# EAGLE design lcsc (EAGLE 7.5.0)
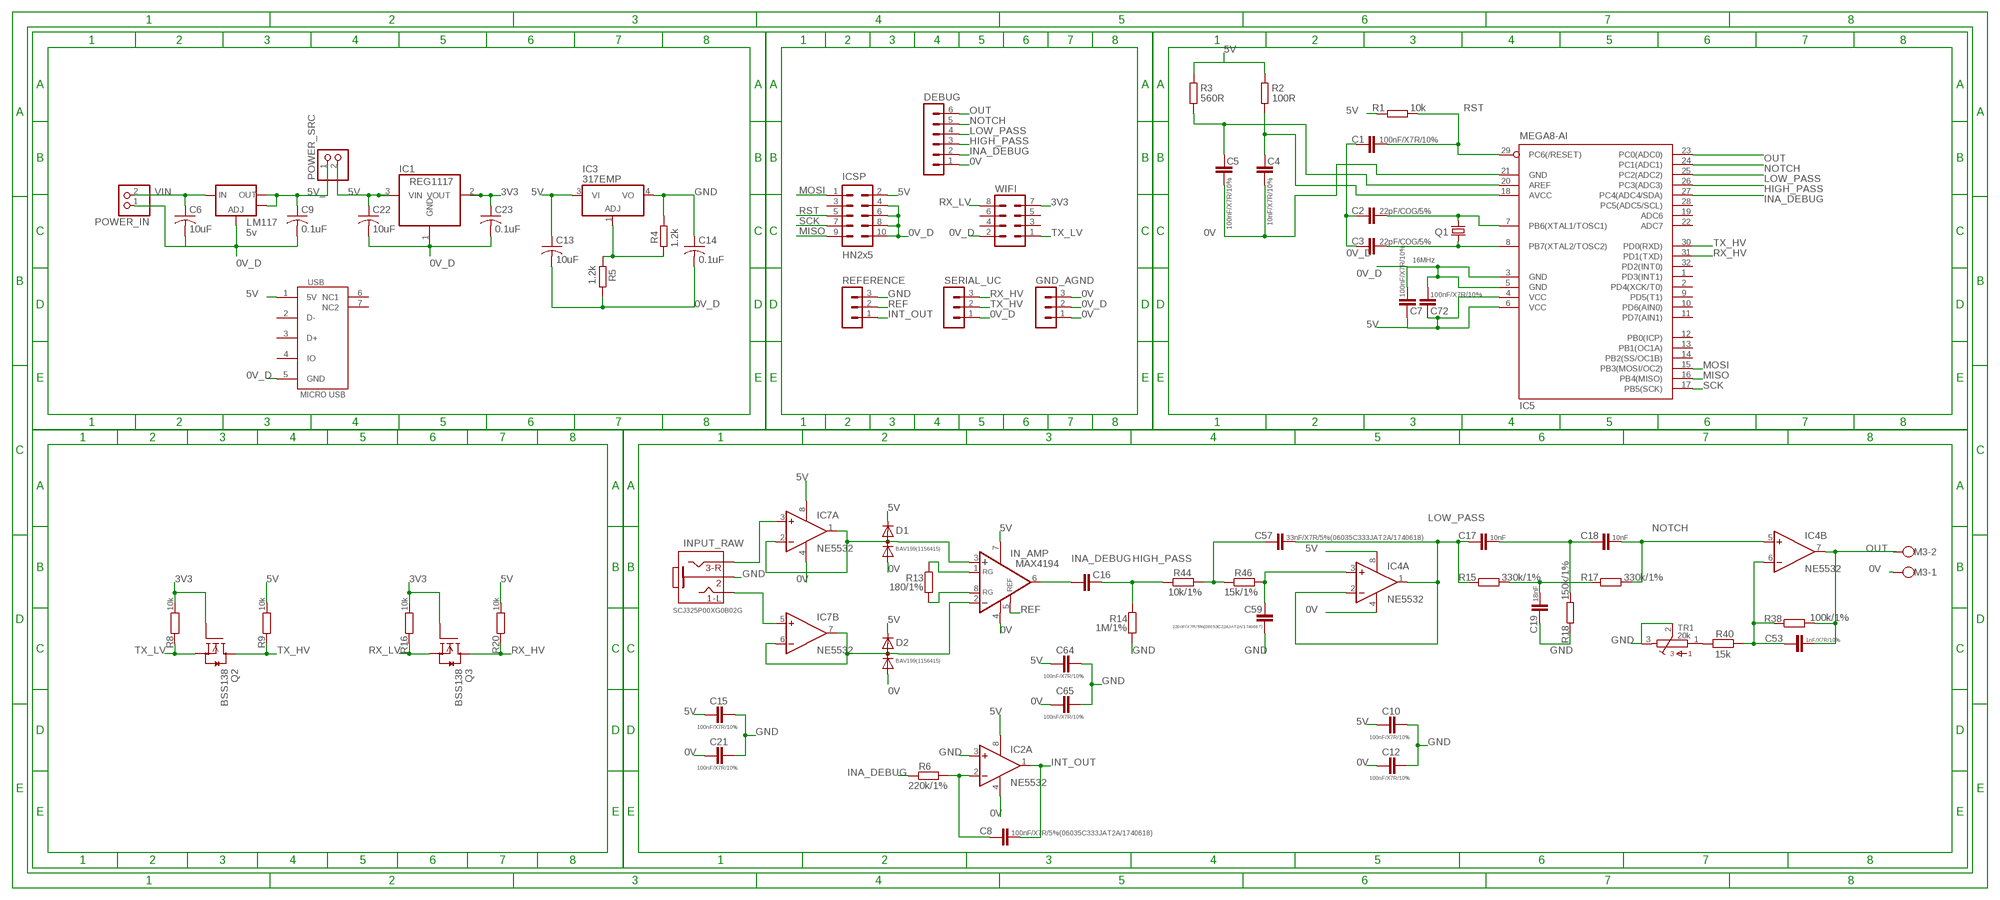
[diagram p0: schematic, sheet 1]

## Parts
C1  100nF/X7R/10%  C-EUC0603_DWS  [C0603_DWS]
C2  22pF/COG/5%  C-EUC0603_DWS  [C0603_DWS]
C3  22pF/COG/5%  C-EUC0603_DWS  [C0603_DWS]
C4  10nF/X7R/10%  C-EUC0603_DWS  [C0603_DWS]
C5  100nF/X7R/10%  C-EUC0603_DWS  [C0603_DWS]
C6  10uF  C-USC0805  [C0805]
C7  100nF/X7R/10%  C-EUC0603_DWS  [C0603_DWS]
C8  100nF/X7R/5%(06035C333JAT2A/1740618)  C-EUC0603_DWS  [C0603_DWS]
C9  0.1uF  C-USC0805  [C0805]
C10  100nF/X7R/10%  C-EUC0603_DWS  [C0603_DWS]
C12  100nF/X7R/10%  C-EUC0603_DWS  [C0603_DWS]
C13  10uF  C-USC0805  [C0805]
C14  0.1uF  C-USC0805  [C0805]
C15  100nF/X7R/10%  C-EUC0603_DWS  [C0603_DWS]
C16  1uF/X5R/10%  C-EUC0603_DWS  [C0603_DWS]
C17  10nF  C-EUC0603_DWS  [C0603_DWS]
C18  10nF  C-EUC0603_DWS  [C0603_DWS]
C19  18nF  C-EUC0603_DWS  [C0603_DWS]
C21  100nF/X7R/10%  C-EUC0603_DWS  [C0603_DWS]
C22  10uF  C-USC0805  [C0805]
C23  0.1uF  C-USC0805  [C0805]
C53  1nF/X7R/10%  C-EUC0603_DWS  [C0603_DWS]
C57  33nF/X7R/5%(06035C333JAT2A/1740618)  C-EUC0603_DWS  [C0603_DWS]
C59  220nF/X7R/5%(08053C224JAT2A/1740667)  C-EUC0805_5MIL_DWS  [C0805_5MIL_DWS]
C64  100nF/X7R/10%  C-EUC0603_DWS  [C0603_DWS]
C65  100nF/X7R/10%  C-EUC0603_DWS  [C0603_DWS]
C72  100nF/X7R/10%  C-EUC0603_DWS  [C0603_DWS]
D1  BAV199(1156415)  DIODE_AC-AC_  [SOT23C(BAT54S)]
D2  BAV199(1156415)  DIODE_AC-AC_  [SOT23C(BAT54S)]
DEBUG  MA06-1  [MA06-1]
GND_AGND  MA03-1  [MA03-1]
IC1  REG1117  [SOT223]
IC2  NE5532  LMV358M  [SO08]
IC3  317EMP  [SOT223]
IC4  NE5532  LMV358M  [SO08]
IC5  MEGA8-AI  [TQFP32-08]
IC7  NE5532  LMV358M  [SO08]
ICSP  HN2x5  ML10ML10_NEW  [ML10_NEW]
IN_AMP  MAX4194  LT1168ACS8  [SOIC8]
INPUT_RAW  SCJ325P00XG0B02G  JACK-3PINPHONE_JACK-SMD  [PHONE_JACK-SMD]
LM117  5v  V_REG_LM1117SOT223  [SOT223]
M3  W237-102  [W237-102]
POWER_IN  PINHD-1X2  [1X02]
POWER_SRC  PINHD-1X2  [1X02]
Q1  16MHz  HC49/S1  [HC49/SMD2_THIN]
Q2  BSS138  [SOT23]
Q3  BSS138  [SOT23]
R1  10k  R-EU_R0603_5MIL_DWS  [R0603_5MIL_DWS]
R2  100R  R-EU_R0603_5MIL_DWS  [R0603_5MIL_DWS]
R3  560R  R-EU_R0603_5MIL_DWS  [R0603_5MIL_DWS]
R4  1.2k  R-EU_R0603_5MIL_DWS  [R0603_5MIL_DWS]
R5  1.2k  R-EU_R0603_5MIL_DWS  [R0603_5MIL_DWS]
R6  220k/1%  R-EU_R0603_5MIL_DWS  [R0603_5MIL_DWS]
R8  10k  R-EU_R0603_5MIL_DWS  [R0603_5MIL_DWS]
R9  10k  R-EU_R0603_5MIL_DWS  [R0603_5MIL_DWS]
R13  180/1%  R-EU_R0603_5MIL_DWS  [R0603_5MIL_DWS]
R14  1M/1%  R-EU_R0603_5MIL_DWS  [R0603_5MIL_DWS]
R15  330k/1%  R-EU_R0603_5MIL_DWS  [R0603_5MIL_DWS]
R16  10k  R-EU_R0603_5MIL_DWS  [R0603_5MIL_DWS]
R17  330k/1%  R-EU_R0603_5MIL_DWS  [R0603_5MIL_DWS]
R18  150k/1%  R-EU_R0603_5MIL_DWS  [R0603_5MIL_DWS]
R20  10k  R-EU_R0603_5MIL_DWS  [R0603_5MIL_DWS]
R38  100k/1%  R-EU_R0603_5MIL_DWS  [R0603_5MIL_DWS]
R40  15k  R-EU_R0603_5MIL_DWS  [R0603_5MIL_DWS]
R44  10k/1%  R-EU_R0603_5MIL_DWS  [R0603_5MIL_DWS]
R46  15k/1%  R-EU_R0603_5MIL_DWS  [R0603_5MIL_DWS]
REFERENCE  MA03-1  [MA03-1]
SERIAL_UC  MA03-1  [MA03-1]
TR1  20k  S64Y  [S64Y]
USB  MICRO_USB  [MICRO_USB]
WIFI  MA04-2  [MA04-2]

## Nets
0V: C4.2 C5.2 C12.1 C21.1 C65.1 D1.1(A) D2.1(A) DEBUG.1 GND_AGND.1 GND_AGND.3 IC2.4(P:V-) IC4.4(P:V-) IC5.21(GND) IC7.4(P:V-) IN_AMP.4(V-) M3.1
0V_D: C1.2 C2.2 C3.2 C6.2 C7.2 C9.2 C13.2 C14.2 C22.2 C23.2 C72.2 GND_AGND.2 IC1.1(GND) IC5.3(GND) IC5.5(GND) ICSP.4 ICSP.6 ICSP.8 ICSP.10 LM117.1(ADJ) POWER_IN.1 R5.1 SERIAL_UC.1 USB.5(GND) WIFI.2
3V3: C23.1 IC1.2(VOUT) Q2.1(G) Q3.1(G) R8.2 R16.2 WIFI.7
4V_REF_ADC: C5.1 IC5.20(AREF) R3.1
5V: C7.1 C10.1 C13.1 C15.1 C22.1 C64.1 C72.1 D1.2(K) D2.2(K) IC1.3(VIN) IC2.8(P:V+) IC3.3(VI) IC4.8(P:V+) IC5.4(VCC) IC5.6(VCC) IC7.8(P:V+) ICSP.2 IN_AMP.7(V+) POWER_SRC.2 R1.1 R2.2 R3.2 R9.2 R20.2 USB.1(5V)
5V_: C9.1 LM117.2(OUT) LM117.4(OUT) POWER_SRC.1
GND: C10.2 C12.2 C14.1 C15.2 C19.1 C21.2 C59.2 C64.2 C65.2 IC2.3(A:+IN) IC3.4(VO) INPUT_RAW.1 R4.1 R14.2 R18.1 REFERENCE.3 TR1.2 TR1.3
HIGH_PASS: C16.2 DEBUG.3 IC5.26(PC3(ADC3)) R14.1 R44.1
INA_DEBUG: C16.1 DEBUG.2 IC5.27(PC4(ADC4/SDA)) IN_AMP.6(OUT) R6.1
INT_OUT: C8.2 IC2.1(A:OUT) REFERENCE.1
LOW_PASS: C17.1 C57.2 DEBUG.4 IC4.1(A:OUT) IC4.2(A:-IN) IC5.25(PC2(ADC2)) R15.1
MISO: IC5.16(PB4(MISO)) ICSP.9
MOSI: IC5.15(PB3(MOSI/OC2)) ICSP.1
N$1: IN_AMP.1(RG) R13.1
N$2: IN_AMP.8(RG) R13.2
N$3: D1.3(AK) IC7.1(A:OUT) IC7.2(A:-IN) IN_AMP.3(+IN)
N$4: IC7.3(A:+IN) INPUT_RAW.2
N$5: IC7.5(B:+IN) INPUT_RAW.5
N$6: IC3.1(ADJ) R4.2 R5.2
N$7: C8.1 IC2.2(A:-IN) R6.2
N$8: C19.2 R15.2 R17.1
N$9: C17.2 C18.1 R18.2
N$11: D2.3(AK) IC7.6(B:-IN) IC7.7(B:OUT) IN_AMP.2(-IN)
N$21: C4.1 IC5.18(AVCC) R2.1
N$27: C3.1 IC5.8(PB7(XTAL2/TOSC2)) Q1.2
N$28: C2.1 IC5.7(PB6(XTAL1/TOSC1)) Q1.1
N$29: R40.2 TR1.1
N$105: C53.1 IC4.6(B:-IN) R38.1 R40.1
N$107: C59.1 IC4.3(A:+IN) R46.2
N$108: C57.1 R44.2 R46.1
NOTCH: C18.2 DEBUG.5 IC4.5(B:+IN) IC5.24(PC1(ADC1)) R17.2
OUT: C53.2 DEBUG.6 IC4.7(B:OUT) IC5.23(PC0(ADC0)) M3.2 R38.2
REF: IN_AMP.5(REF) REFERENCE.2
RST: C1.1 IC5.29(PC6(/RESET)) ICSP.5 R1.2
RX_HV: IC5.31(PD1(TXD)) Q3.3(D) R20.1 SERIAL_UC.3
RX_LV: Q3.2(S) R16.1 WIFI.8
SCK: IC5.17(PB5(SCK)) ICSP.7
TX_HV: IC5.30(PD0(RXD)) Q2.3(D) R9.1 SERIAL_UC.2
TX_LV: Q2.2(S) R8.1 WIFI.1
VIN: C6.1 LM117.3(IN) POWER_IN.2
Unconnected: IC2.5(B:+IN) IC2.6(B:-IN) IC2.7(B:OUT) IC5.1(PD3(INT1)) IC5.2(PD4(XCK/T0)) IC5.9(PD5(T1)) IC5.10(PD6(AIN0)) IC5.11(PD7(AIN1)) IC5.12(PB0(ICP)) IC5.13(PB1(OC1A)) IC5.14(PB2(SS/OC1B)) IC5.19(ADC6) IC5.22(ADC7) IC5.28(PC5(ADC5/SCL)) IC5.32(PD2(INT0)) ICSP.3 USB.2(D-) USB.3(D+) USB.4(IO) USB.6(NC1) USB.7(NC2) WIFI.3 WIFI.4 WIFI.5 WIFI.6

## Library data of the parts
C1-C5 C7 C8 C10 C12 C15-C19 C21 C53 C57 C59 C64 C65 C72 = rcl:C-EU: CAPACITOR, European symbol
C6 C9 C13 C14 C22 C23 = resistor:C-US: CAPACITOR, American symbol
D1 D2 = semicon-smd-ipc:DIODE_AC-AC_: DUAL DIODE
DEBUG = con-lstb:MA06-1: PIN HEADER; OC_FARNELL: unknown; OC_NEWARK: unknown
GND_AGND REFERENCE SERIAL_UC = con-lstb:MA03-1: PIN HEADER; OC_FARNELL: unknown; OC_NEWARK: unknown
IC1 = burr-brown:REG1117: 800mA and 1A Low Dropout (LDO) Positive Regulator 1.8V, 2.5V, 2.85V, 3.3V, 5V, and Adj; MPN: REG1117; OC_FARNELL: 1097566; OC_NEWARK: 14P6981
IC2 IC4 IC7 = linear:LMV358?*: Dual General Purpose, Low Voltage, Rail-to-Rail Output Operational Amplifiers Source: http://www.national.com/mpf/LM/LMV321.html http://www.national.com/dt/lmv_qual.pdf
IC3 = linear:*317: Positive VOLTAGE REGULATOR
IC5 = atmel:MEGA8: MICROCONTROLLER 8 Kbytes FLASH, 1 kbytes SRAM, 512 bytes EEPROM, USART, 6-channel 10 bit ADC, 2-channel 8 bit ADC Pin compatible with Atmega48, ATMega88, ATMega168 Source: avr.lbr; MPN: ATMEGA8-16AU; OC_FARNELL: 9171371; OC_NEWARK: 73M8863
ICSP = con-harting-ml:ML10: HARTING
IN_AMP = linear-technology:LT1168: Low Power, Single Resistor Gain Programmable, Precision Instrumentation Amplifier SourcE: LT1168.pdf; MPN: LT1168ACS8; OC_FARNELL: unknown; OC_NEWARK: 57M2316
INPUT_RAW = gogo:JACK-3PIN
LM117 = SparkFun:V_REG_LM1117: Voltage Regulator LM1117 Standard adjustable voltage regulator but in SMD form. Spark Fun Electronics SKU : COM-00595
M3 = con-wago-500:W237-102: WAGO SCREW CLAMP; MPN: 237-102; OC_FARNELL: unknown; OC_NEWARK: 70K9898
POWER_IN POWER_SRC = pinhead:PINHD-1X2: PIN HEADER
Q1 = crystal:HC49/S: CRYSTAL
Q2 Q3 = m-pad-2.1:BSS138: Fairchild Semiconductors BSS138 N-Channel Logic Level Enhancement Mode Field Effect Transistor General Description: These N-Channel enhancement mode field effect transistors are produced using Fairchild's proprietary, high cell density, DMOS technology. These products have been designed to minimize on-state resistance while provide rugged, reliable, and fast switching performance.These products are particularly suited for low voltage, low current applications such as small servo motor control, power MOSFET gate drivers, and other switching applications. Features: 0.22 A, 50 V. RDS(ON) = 3.5Ohm @ VGS = 10 V RDS(ON) = 6.0Ohm @ VGS = 4.5 V High density cell design for extremely low RDS(ON) Rugged and Reliable Compact industry standard SOT-23 surface mount package Please send any comments to: messi@users.sourceforge.net
R1-R6 R8 R9 R13-R18 R20 R38 R40 R44 R46 = rcl:R-EU_: RESISTOR, European symbol
TR1 = TRIMPOT:S64Y
USB = micro_usb:MICRO_USB
WIFI = con-lstb:MA04-2: PIN HEADER; OC_FARNELL: unknown; OC_NEWARK: unknown

## Net classes
1 pwr: width 0.4 mm, clearance 0.23 mm

## Board
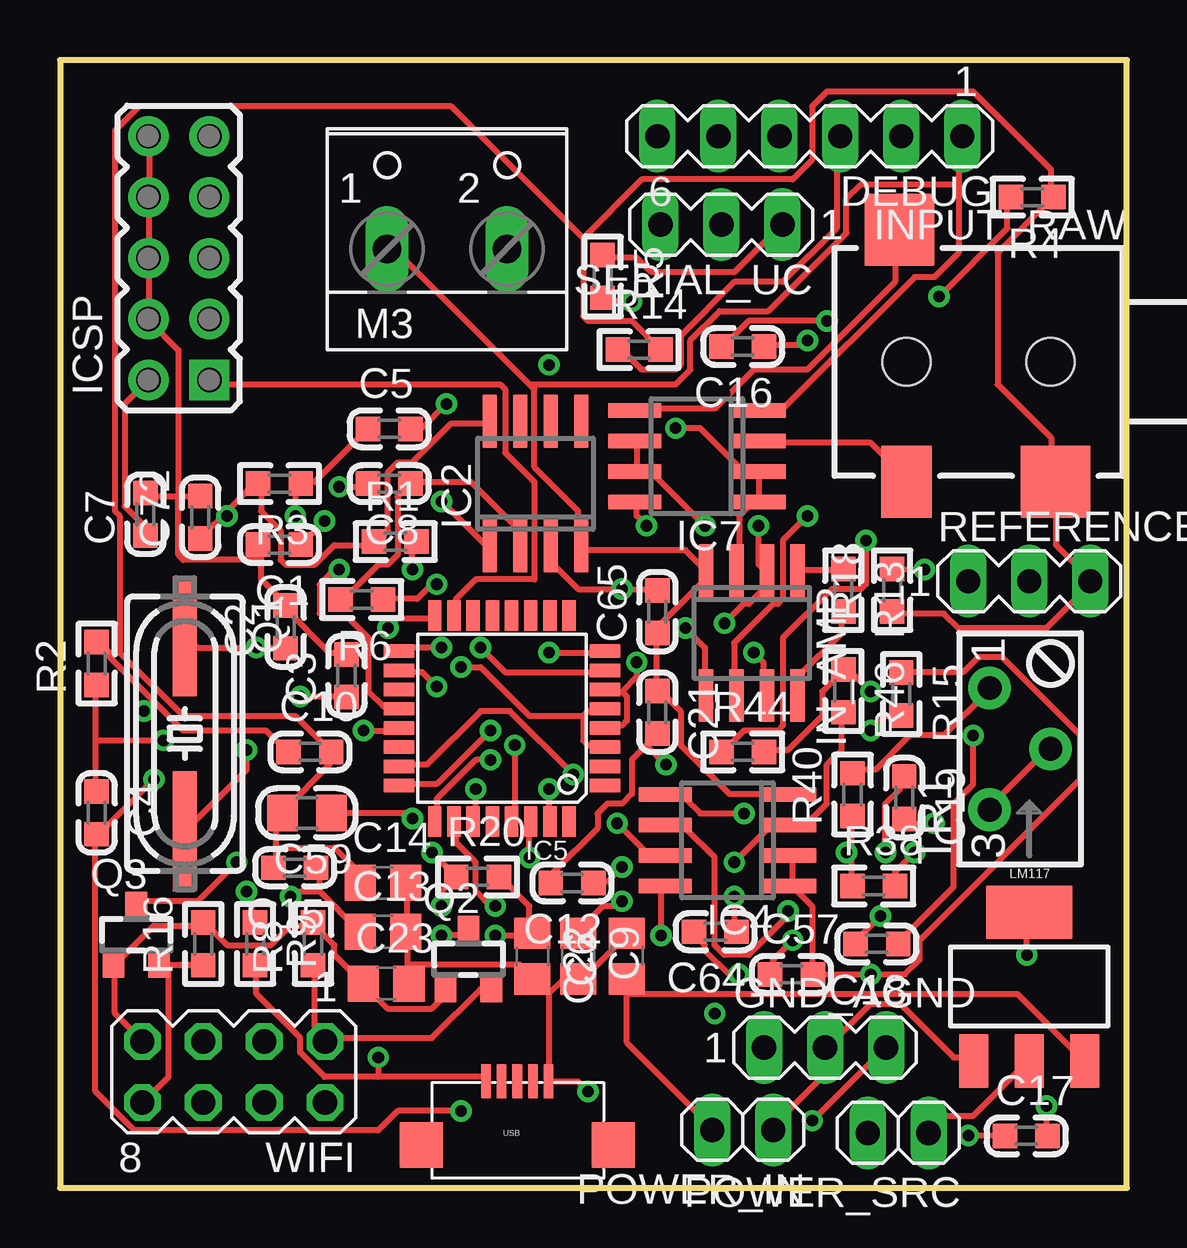
[diagram p1: board, top side]
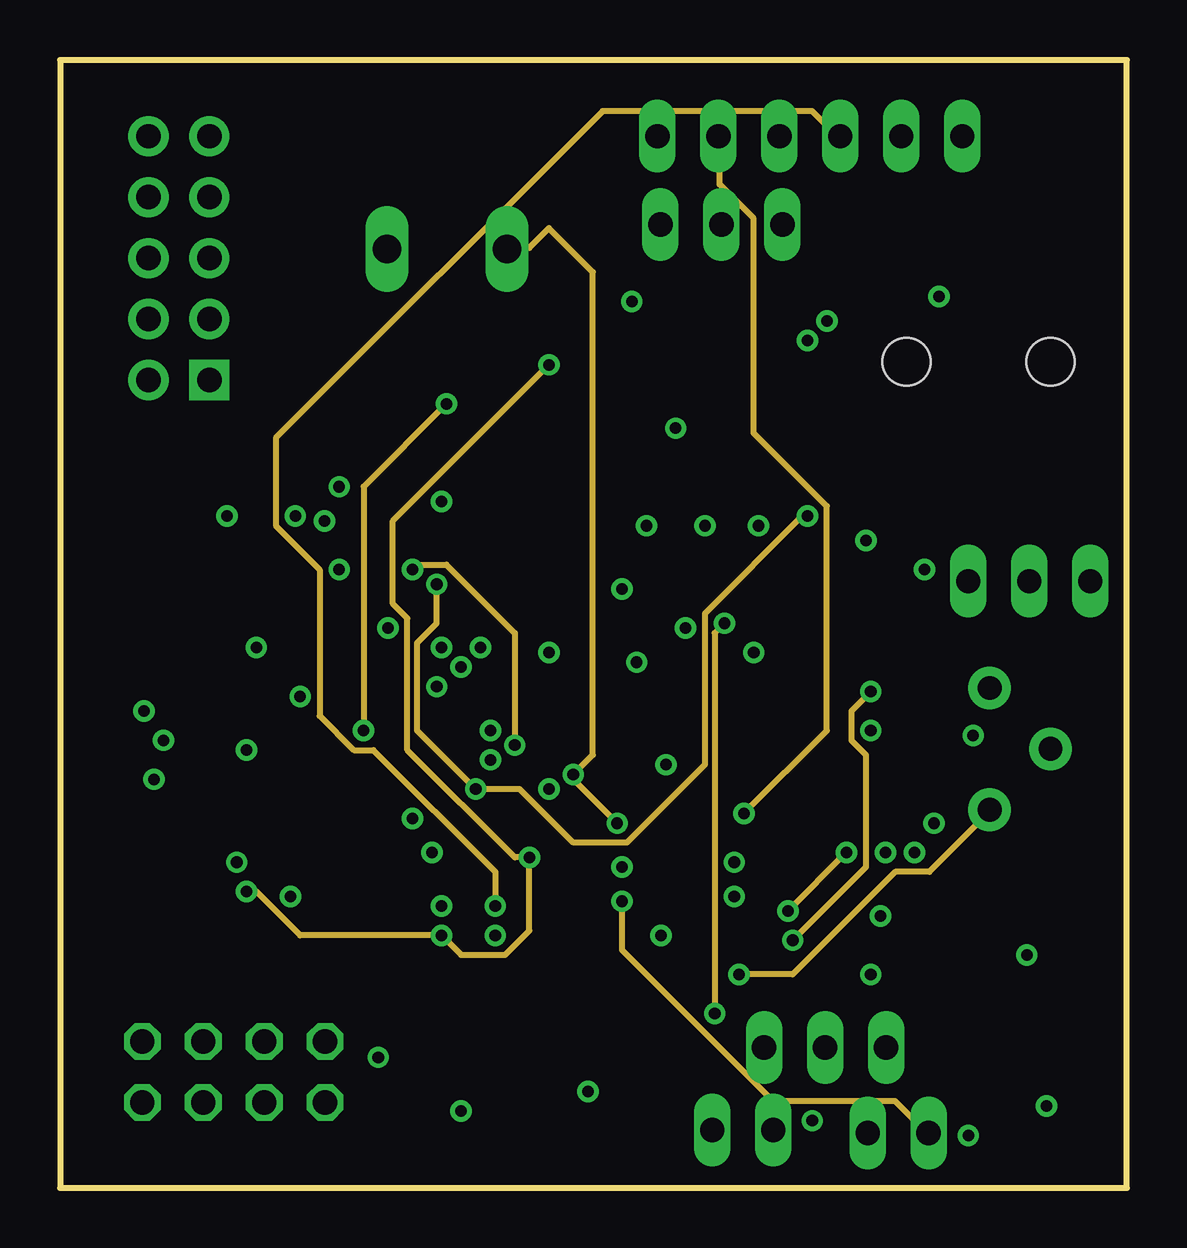
[diagram p2: board, inner layer Route2]
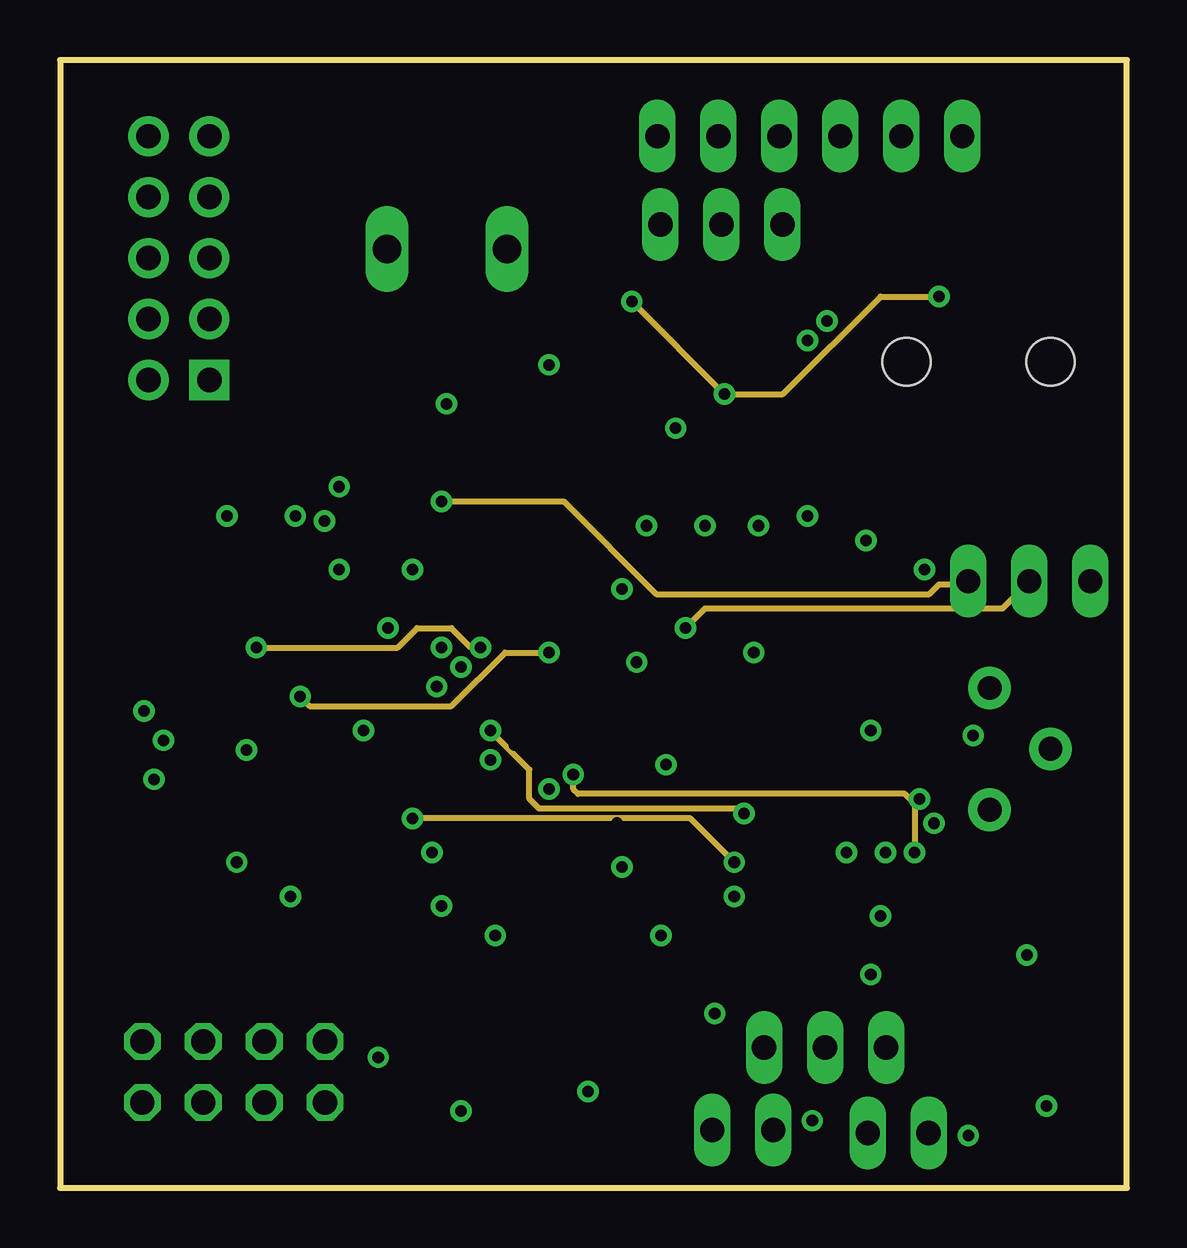
[diagram p3: board, inner layer Route15]
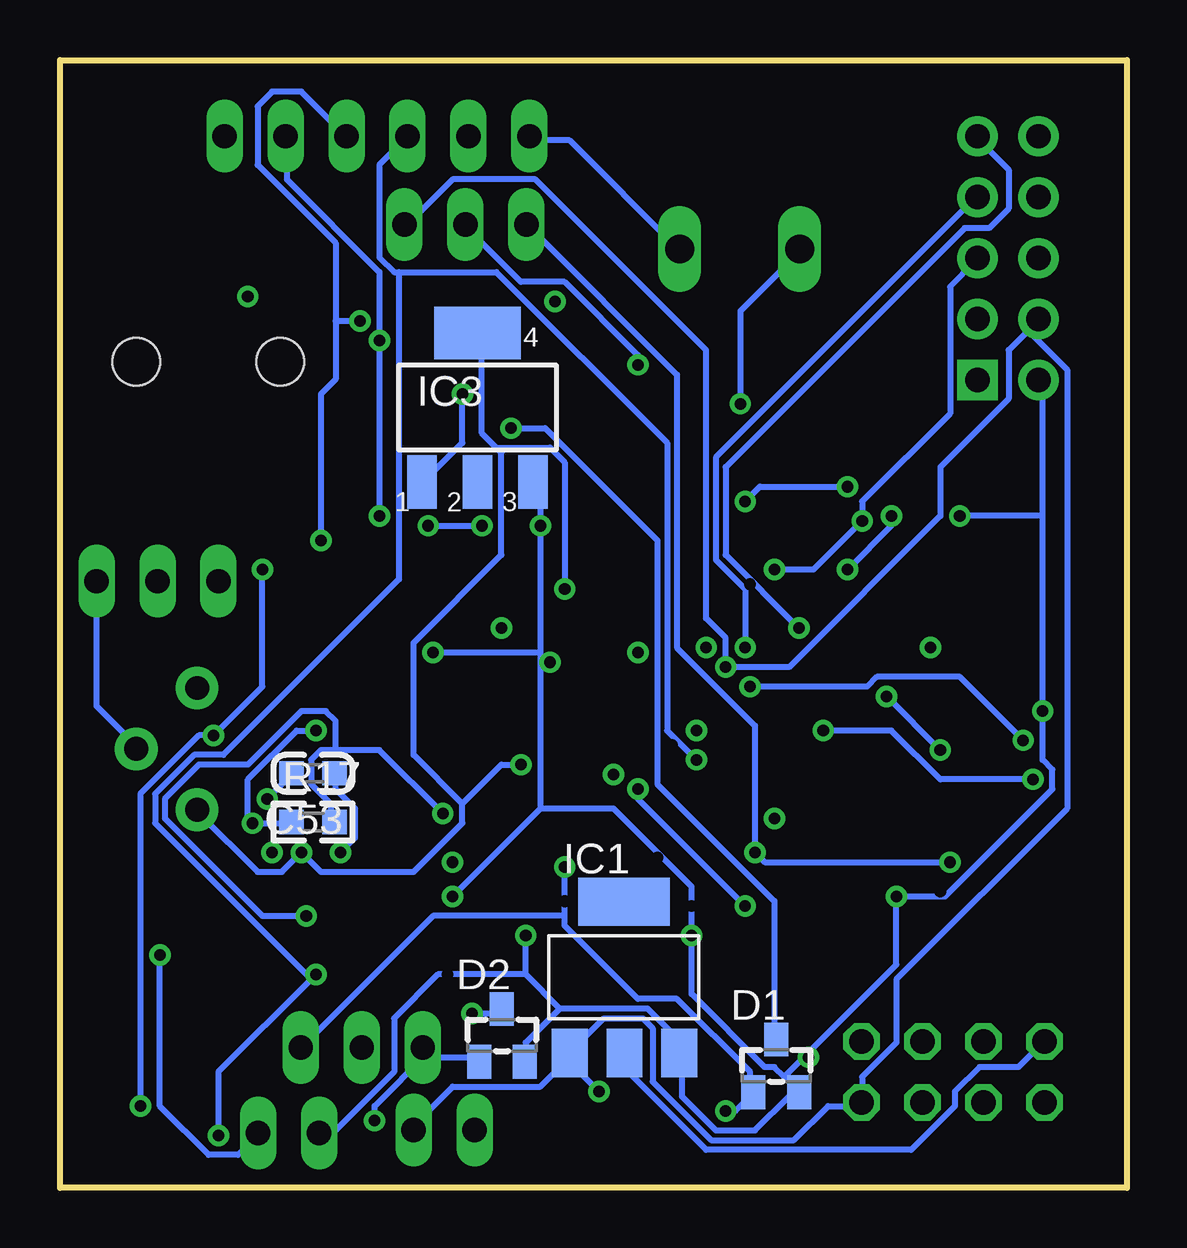
[diagram p4: board, bottom side, seen from below]

Size 44.45 x 46.99 mm. Coordinates in mm from the lower left corner, seen from the top.
Outline: 0,46.99 0,0 44.45,0 44.45,46.99 0,46.99
Copper layers ((1*2)+(15*16)): Top 0.09mm / dielectric 0.2mm / Route2 0.07mm / dielectric 1.5mm / Route15 0.07mm / dielectric 0.2mm / Bottom 0.09mm
Design rules "default *": minimum track width 10mil, minimum drill 19mil, track to track 6mil, track to pad 6mil, pad to pad 8mil, via to via 8mil, smd to smd 6mil, copper to edge 40mil, drill to drill 8mil, minimum pad ring 10mil, minimum via ring 8mil, stop-mask expansion 4mil, vias tented up to drill 0mil, thermal gap 10mil

### Footprints (pad centres in the part's own frame; a part is rotated, then mirrored left to right if it is on the bottom)
C0603_DWS = smd 1.016 x 1.016: 1 -0.889,0; 2 0.889,0
C0805 = smd 1.3 x 1.5: 1 -0.95,0; 2 0.95,0
C0805_5MIL_DWS = smd 1.27 x 1.524: 1 -1.016,0; 2 1.016,0
SOT23C(BAT54S) = smd 1 x 1.4: 1 -0.95,-1.1; 2 0.95,-1.1; 3 0,1.1
MA06-1 = drill 1.016 long: 1 -6.35,0; 2 -3.81,0; 3 -1.27,0; 4 1.27,0; 5 3.81,0; 6 6.35,0
MA03-1 = drill 1.016 long: 1 -2.54,0; 2 0,0; 3 2.54,0
SOT223 = smd 1.499 x 2.007: 1 -2.261,-3.15; 2 0.025,-3.15; 3 2.311,-3.15 | smd 3.81 x 2.007: 4 0,3.15
SO08 = smd 0.6 x 2.2: 1 -1.905,-2.6; 2 -0.635,-2.6; 3 0.635,-2.6; 4 1.905,-2.6; 5 1.905,2.6; 6 0.635,2.6; 7 -0.635,2.6; 8 -1.905,2.6
SOT223' = smd 1.219 x 2.235: 1 -2.311,-3.099; 2 0,-3.099; 3 2.311,-3.099 | smd 3.6 x 2.2: 4 0,3.099
TQFP32-08 = smd 1.27 x 0.559: 1 -4.293,2.8; 2 -4.293,2; 3 -4.293,1.2; 4 -4.293,0.4; 5 -4.293,-0.4; 6 -4.293,-1.2; 7 -4.293,-2; 8 -4.293,-2.8; 17 4.293,-2.8; 18 4.293,-2; 19 4.293,-1.2; 20 4.293,-0.4; 21 4.293,0.4; 22 4.293,1.2; 23 4.293,2; 24 4.293,2.8 | smd 0.559 x 1.27: 9 -2.8,-4.293; 10 -2,-4.293; 11 -1.2,-4.293; 12 -0.4,-4.293; 13 0.4,-4.293; 14 1.2,-4.293; 15 2,-4.293; 16 2.8,-4.293; 25 2.8,4.293; 26 2,4.293; 27 1.2,4.293; 28 0.4,4.293; 29 -0.4,4.293; 30 -1.2,4.293; 31 -2,4.293; 32 -2.8,4.293
ML10_NEW = drill 1.016 pad 1.676 square: 1 -5.08,-1.27 | drill 1.016 pad 1.676: 2 -5.08,1.27; 3 -2.54,-1.27; 4 -2.54,1.27; 5 0,-1.27; 6 0,1.27; 7 2.54,-1.27; 8 2.54,1.27; 9 5.08,-1.27; 10 5.08,1.27
SOIC8 = smd 0.6 x 2.2: 1 -1.905,-2.6; 2 -0.635,-2.6; 3 0.635,-2.6; 4 1.905,-2.6; 5 1.905,2.6; 6 0.635,2.6; 7 -0.635,2.6; 8 -1.905,2.6
PHONE_JACK-SMD = smd 2.9 x 3: 1 -0.2,5; 5 6.3,-5.5 | smd 2.1 x 3: 2 6,5 | hole 2: 0,0; 6,0
W237-102 = drill 1.194 long: 1 -2.5,-1.27; 2 2.5,-1.27
1X02 = drill 1.016 long: 1 -1.27,0; 2 1.27,0
HC49/SMD2_THIN = smd 5 x 1: 1 -4.064,0; 2 4.064,0
SOT23 = smd 0.9 x 1.2: 1 -0.95,-1.2; 2 0.95,-1.2; 3 0,1.2
R0603_5MIL_DWS = smd 1.016 x 1.016: 1 -0.889,0; 2 0.889,0
S64Y = drill 0.991 pad 1.778: 1 2.54,1.27; 2 0,-1.27; 3 -2.54,1.27
MICRO_USB = smd 0.4 x 1.4: 1 -1.3,2.15; 2 -0.65,2.15; 3 0,2.15; 4 0.65,2.15; 5 1.3,2.15 | smd 1.8 x 1.9: 6 -4,-0.5; 7 4,-0.5
MA04-2 = drill 1.016 octagon: 1 -3.81,-1.27; 2 -3.81,1.27; 3 -1.27,-1.27; 4 -1.27,1.27; 5 1.27,-1.27; 6 1.27,1.27; 7 3.81,-1.27; 8 3.81,1.27

### Placement (x,y rotation side)
C1  9.14,26.8 180 top
C2  9.4,23.37 90 top
C3  11.94,21.34 90 top
C4  1.52,15.62 270 top
C5  13.72,31.62 0 top
C6  23.62,9.65 90 top
C7  3.56,28.07 90 top
C8  13.72,29.34 180 top
C9  21.59,9.65 270 top
C10  10.41,18.16 0 top
C12  21.34,12.7 180 top
C13  13.46,10.67 0 top
C14  13.46,12.7 0 top
C15  9.78,13.34 180 top
C16  28.45,35.05 180 top
C17  40.26,2.16 0 top
C18  34.04,10.16 180 top
C19  35.18,16.26 270 top
C21  24.89,19.81 270 top
C22  19.69,9.65 270 top
C23  13.59,8.51 0 top
C53  33.91,17.27 180 bottom
C57  30.48,8.89 0 top
C59  10.29,15.62 180 top
C64  27.31,10.67 180 top
C65  24.89,24 90 top
C72  5.84,27.94 90 top
D1  14.61,5.08 0 bottom
D2  26.04,6.35 0 bottom
DEBUG  31.24,43.81 180 top
GND_AGND  31.88,5.84 0 top
IC1  20.96,8.76 0 bottom
IC2  19.81,29.34 0 top
IC3  317EMP  [SOT223']  27.05,32.51 0 bottom
IC4  27.81,14.48 90 top
IC5  18.41,19.56 180 top
IC7  26.54,30.48 90 top
ICSP  4.95,38.73 90 top
IN_AMP  28.83,23.11 180 top
INPUT_RAW  41.28,34.42 180 top
LM117  5v  [SOT223']  40.39,8.38 0 top
M3  16.13,40.39 0 top
POWER_IN  28.45,2.41 180 top
POWER_SRC  34.93,2.29 180 top
Q1  5.21,18.92 270 top
Q2  17.02,9.53 0 top
Q3  3.18,10.54 0 top
R1  13.97,26.92 0 top
R2  1.52,21.84 90 top
R3  9.14,29.34 180 top
R4  40.51,41.27 180 top
R5  22.61,37.97 270 top
R6  12.57,24.51 180 top
R8  10.54,10.16 90 top
R9  8.13,10.16 270 top
R13  32.64,24.89 270 top
R14  24.13,34.92 0 top
R15  35.05,20.57 270 top
R16  5.97,10.16 90 top
R17  33.91,15.24 0 bottom
R18  34.67,24.89 90 top
R20  17.4,12.95 0 top
R38  33.91,12.57 0 top
R40  33.02,16.38 90 top
R44  28.45,18.16 0 top
R46  32.64,20.7 270 top
REFERENCE  40.39,25.27 0 top
SERIAL_UC  27.56,40.13 180 top
TR1  40.01,18.29 90 top
USB  19.05,2.29 0 top
WIFI  7.24,4.83 180 top

### Tracks (layer width: path | path; a pad name or v marks a point on that pad's centre or on a via)
0V  (via drill 0.48)
  Top 0.254: v16.71,3.2 14.07,3.2 13.26,2.39 3.1,2.39 1.47,4.01 1.47,14.58 C4.2 1.68,14.78 v3.91,17.02 | v23.42,13.36 22.81,12.75 22.4,12.75 C12.1 | v12.65,19.05 14.07,19.05 IC5.21 | v31.34,2.79 34.39,5.84 GND_AGND.3 | 37.44,41.81 37.44,43.64 DEBUG.1 | 37.44,41.81 37.44,38.96 36.42,37.95 35.61,37.95 30.12,32.46 29.31,32.46 IC7.4 | v16.1,32.66 15.09,31.65 14.68,31.65 C5.2 | IC4.4 30.33,16.41 27.89,16.41 25.86,18.44 25.86,19.86 25.04,20.68 C21.1 24.84,20.88 24.84,23.11 C65.1 25.04,23.11 25.04,23.52 27.08,25.55 IN_AMP.4 26.87,25.76 26.06,26.57 21.79,26.57 IC2.4 21.59,26.77 21.59,28.19 19.76,30.02 19.76,33.27 19.56,33.48 | 19.56,33.48 14.07,38.96 13.67,38.96 M3.1 | 37.44,41.81 33.38,41.81 32.77,41.2 32.77,39.78 29.52,36.52 27.48,36.52 26.26,35.31 26.26,34.09 25.65,33.48 19.56,33.48
  Route2 0.254: v12.65,19.05 12.65,29.21 v16.1,32.66
  Bottom 0.254: 29.11,5.64 29.31,5.84 GND_AGND.1 29.11,5.64 | 29.11,5.64 28.91,5.44 27.08,5.44 D2.1 | v16.71,3.2 16.31,3.2 15.7,3.81 D1.1 15.7,4.01 15.7,4.83 18.75,7.87 20.37,7.87 23.42,10.92 23.42,11.33 | 23.42,11.33 v23.42,13.36 | v12.65,19.05 9.8,19.05 7.77,17.02 v3.91,17.02 | 23.42,11.33 28.91,11.33 34.39,5.84 GND_AGND.3 | 29.11,5.64 31.34,3.4 v31.34,2.79 | v16.1,32.66 16.1,36.52 13.67,38.96 M3.1
0V_D  (via drill 0.48)
  Top 0.254: 14.48,9.3 14.48,10.52 C13.2 14.48,10.72 14.48,12.55 C14.2 | 14.48,9.3 14.48,8.69 C23.2 | 20.37,8.08 20.37,4.62 USB.5 20.37,4.42 21.59,4.42 v22,4.01 | 20.37,8.08 19.76,8.69 C22.2 | 20.37,8.08 20.98,8.69 21.59,8.69 C9.2 21.59,8.89 22,8.89 23.62,10.52 C6.2 | 20.37,8.08 C22.2 | 14.48,9.3 19.15,9.3 19.56,8.89 C22.2 | LM117.1 38.05,5.44 37.24,5.44 35,7.67 33.78,7.67 31.95,5.84 GND_AGND.2 31.75,5.84 31.75,4.62 29.72,2.59 POWER_IN.1 | 4.93,28.8 3.71,28.8 C7.2 | 4.93,28.8 5.74,28.8 C72.2 | 8.38,26.16 8.38,25.35 9.4,24.33 C2.2 9.4,24.13 11.23,22.3 11.84,22.3 C3.2 | 8.38,26.16 8.38,26.77 C1.2 | 4.93,28.8 4.93,26.37 5.13,26.16 8.38,26.16 | R5.1 22.61,38.76 24.03,38.76 24.64,38.15 28.09,38.15 29.92,39.98 SERIAL_UC.1 | ICSP.10 3.71,43.64 3.71,41.4 ICSP.8 3.71,41.2 3.71,38.76 ICSP.6 3.71,38.56 3.71,36.32 ICSP.4 3.71,36.12 4.93,34.9 4.93,28.8 | 21.79,19.66 21.79,18.64 22,18.44 22.61,18.44 IC5.3 | 21.79,19.66 22,19.86 22.61,19.86 IC5.5 | 21.79,19.66 19.56,19.66 17.53,21.69 v16.71,21.69
  Bottom 0.254: 23.22,5.44 24.44,4.22 28.09,4.22 29.72,2.59 POWER_IN.1 | v22,4.01 23.22,5.23 23.22,5.44 | 23.22,5.44 IC1.1 23.22,5.64 21.79,7.06 20.17,7.06 19.76,6.66 19.76,4.42 17.32,1.98 13.87,1.98 12.45,3.4 11.23,3.4 WIFI.2 11.02,3.61 11.02,4.62 9.6,6.05 9.6,8.69 2.49,15.8 2.49,34.09 4.12,35.71 | 4.12,35.71 3.71,36.12 ICSP.4 4.12,35.71 | 4.12,35.71 4.93,34.9 4.93,32.87 7.77,30.02 7.77,27.99 14.07,21.69 v16.71,21.69 16.71,22.91 17.53,23.72 17.53,34.9 24.64,42.01 28.09,42.01 29.92,40.18 SERIAL_UC.1
3V3
  Top 0.254: Q2.1 15.9,8.28 15.9,7.87 15.49,7.47 13.67,7.47 12.65,8.48 C23.1 12.45,8.69 11.43,9.7 11.43,10.11 10.62,10.92 R8.2 10.41,10.92 9.6,10.92 8.79,10.11 6.96,10.11 6.15,10.92 R16.2 5.94,10.92 3.91,10.92 2.29,9.3 | 2.29,9.3 2.29,7.26 3.3,6.25 WIFI.7 | 2.29,9.3 Q3.1
  Bottom 0.254: IC1.2 20.78,5.44 20.78,4.83 17.53,1.57 8.99,1.57 7.16,3.4 7.16,4.01 6.15,5.03 4.52,5.03 3.51,6.05 WIFI.7
4V_REF_ADC  (via drill 0.48)
  Top 0.254: C5.1 10.62,29.41 10.21,29.41 R3.1 10.01,29.21 9.8,29.01 v9.8,27.99 | v11.63,25.76 11.43,25.76 10.82,25.15 10.82,23.93 11.02,23.72 12.04,23.72 12.85,22.91 12.85,20.68 13.46,20.07 14.07,20.07 IC5.20
  Bottom 0.254: v11.63,25.76 9.8,27.58 v9.8,27.99
5V  (via drill 0.48)
  Top 0.254: 23.42,20.68 23.62,20.47 23.62,19.46 23.42,19.25 22.81,19.25 IC5.4 | 23.42,20.68 22.81,20.68 IC5.6 | v28.09,12.14 28.09,10.72 C64.1 | 23.42,20.68 24.03,21.29 v24.03,21.89 | v24.44,27.58 24.03,27.99 24.03,28.4 IC7.8 | v28.91,22.3 29.31,21.89 29.31,20.68 IN_AMP.7 | 6.96,28.19 8.18,29.41 R3.2 8.38,29.21 8.38,28.19 9.2,27.38 9.2,26.16 9.4,25.96 10.62,25.96 11.43,26.77 13.06,26.77 R1.1 13.26,26.98 13.67,27.38 13.67,29.82 14.07,30.23 14.68,30.23 16.31,31.85 17.73,31.85 IC2.8 | 6.96,28.19 5.94,27.18 C72.1 | 13.26,4.62 17.73,4.62 USB.1 | 13.26,4.62 11.02,4.62 10.01,5.64 10.01,6.25 8.18,8.08 8.18,9.09 R9.2 | 3.91,20.27 5.13,19.05 8.59,19.05 9.4,18.24 C10.1 | 3.91,20.27 2.08,22.1 2.08,22.3 1.68,22.71 R2.2 | ICSP.2 2.69,32.66 2.69,28.4 3.51,27.58 3.51,27.18 C7.1 | 10.82,12.34 10.82,13.16 C15.1 | 10.82,12.34 12.45,10.72 C13.1 | R20.2 18.34,12.95 19.56,11.73 19.56,10.72 C22.1 19.56,10.52 v18.14,10.52 | v25.04,10.52 25.04,12.55 IC4.8 | 10.82,12.34 9.8,12.34 v9.6,12.14 | v3.51,19.86 3.91,20.27 | v13.26,5.44 13.26,4.62 | v6.96,27.99 6.96,28.19
  Bottom 0.254: 24.44,15.8 v28.09,12.14 | 24.44,22.3 v24.44,27.58 24.44,29.21 24.64,29.41 IC3.3 | 24.44,22.3 24.44,21.89 | 24.44,21.89 24.44,15.8 | 24.44,21.89 v24.03,21.89 | 24.44,22.3 v28.91,22.3 | 23.62,7.47 25.04,6.05 25.04,5.44 D2.2 | 23.62,7.47 19.96,7.47 18.75,6.25 18.75,5.64 IC1.3 18.54,5.44 18.54,3.81 17.12,2.39 15.49,2.39 14.07,3.81 13.67,3.81 D1.2 13.67,4.01 14.28,4.62 | 25.04,8.89 v25.04,10.52 | 23.62,7.47 25.04,8.89 | 14.28,4.62 14.68,5.03 15.09,5.03 18.14,8.08 v18.14,10.52 18.14,12.55 21.39,15.8 24.44,15.8 | 14.28,4.62 13.26,5.64 | 13.26,5.64 9.6,9.3 v9.6,12.14 7.57,12.14 3.1,16.61 3.1,17.42 3.51,17.83 v3.51,19.86 3.51,27.99 | 25.04,8.89 28.7,8.89 30.53,7.06 30.53,4.83 32.97,2.39 33.58,2.39 POWER_SRC.2 | 3.51,27.99 3.51,33.48 ICSP.2 | 13.26,5.64 v13.26,5.44 | 3.51,27.99 v6.96,27.99
5V_  (via drill 0.48, 0.48 layers 1-2)
  Top 0.254: v23.42,11.94 23.22,11.73 22.61,11.73 21.59,10.72 C9.1 | LM117.2 40.28,5.23 38.05,3 36.83,3 36.22,2.39 POWER_SRC.1 | v40.28,9.7 40.28,11.33 LM117.4
  Route2 0.254: v23.42,11.94 23.42,9.91 29.72,3.61 34.8,3.61 36.02,2.39 POWER_SRC.1
  Bottom 0.254: v40.28,9.7 40.28,3.4 38.25,1.37 37.03,1.37 36.22,2.18 POWER_SRC.1
GND  (via drill 0.48, 0.48 layers 1-2)
  Top 0.254: R18.1 34.8,23.93 36.83,23.93 37.44,23.32 41.1,23.32 42.93,25.15 REFERENCE.3 42.93,25.35 41.5,26.77 41.5,29.41 INPUT_RAW.1 41.3,29.62 41.3,31.24 39.06,33.48 39.06,38.96 41.3,41.2 R4.1 41.3,41.4 41.3,42.42 38.05,45.67 31.95,45.67 31.34,45.06 31.34,42.82 30.53,42.01 24.23,42.01 21.79,39.57 | 24.44,18.44 24.84,18.85 C21.2 24.44,18.44 | 24.44,18.44 23.83,17.83 23.83,16.41 23.42,16 22.81,16 22.4,15.6 22.4,14.99 20.57,13.16 20.57,12.75 C12.2 | C65.2 24.84,24.94 v23.42,24.94 21.59,24.94 20.57,25.96 20.57,26.57 IC2.3 | v28.3,8.89 27.89,8.89 26.87,9.91 26.87,10.11 26.47,10.52 C64.2 | v34.39,13.97 34.39,16 35,16.61 35,17.02 C19.1 | TR1.2 41.1,18.24 38.66,15.8 TR1.3 | v25.25,17.63 24.44,18.44 | 8.99,14.17 8.99,15.39 9.2,15.6 C59.2 9.4,15.8 11.23,17.63 11.23,18.03 C10.2 9.8,19.66 5.13,19.66 2.49,22.3 2.49,27.99 2.29,28.19 2.29,44.04 3.3,45.06 16.31,45.06 21.79,39.57 | 8.99,14.17 8.99,13.36 C15.2 | 8.99,14.17 11.43,14.17 12.45,13.16 12.45,12.75 C14.1 | R14.2 23.83,36.12 22,36.12 21.79,36.32 21.79,39.57
  Route2 0.254: v28.3,8.89 30.53,8.89 34.8,13.16 36.22,13.16 38.66,15.6 TR1.3
  Bottom 0.254: TR1.3 38.66,15.6 36.22,13.16 35.2,13.16 v34.39,13.97 33.58,13.16 29.72,13.16 27.69,15.19 27.69,16 | 26.26,30.84 26.06,30.63 26.06,26.37 29.72,22.71 29.72,18.03 27.69,16 | 26.26,30.84 26.87,31.45 26.87,35.51 IC3.4 | v23.42,24.94 23.42,30.23 24.03,30.84 26.26,30.84 | v25.25,17.63 26.06,17.63 27.69,16 | REFERENCE.3 42.93,20.07 41.3,18.44 TR1.2
HIGH_PASS  (via drill 0.48, 0.48 layers 1-2)
  Top 0.254: R14.1 23.42,34.9 24.23,34.09 25.65,34.09 25.86,34.29 25.86,35.51 28.09,37.74 30.12,37.74 32.36,39.98 32.36,43.64 DEBUG.3 | v33.58,26.98 33.58,25.15 33.38,24.94 32.16,24.94 30.12,22.91 30.12,19.25 29.92,19.05 28.5,19.05 27.69,18.24 R44.1 | v31.95,36.12 28.7,36.12 27.69,35.1 C16.2 | v18.14,11.73 17.93,11.73 17.32,12.34 17.32,13.56 16.51,14.38 16.51,15.19 IC5.26
  Route2 0.254: v18.14,11.73 18.14,13.16 13.06,18.24 12.24,18.24 10.82,19.66 10.82,25.76 8.99,27.58 8.99,31.24 22.61,44.86 31.34,44.86 32.36,43.84 DEBUG.3
  Bottom 0.254: v33.58,26.98 33.58,33.07 32.97,33.68 32.97,36.12 | 32.97,36.12 32.97,39.37 36.22,42.62 36.22,45.06 35.61,45.67 34.39,45.67 32.56,43.84 DEBUG.3 | 32.97,36.12 v31.95,36.12
INA_DEBUG  (via drill 0.48, 0.48 layers 1-2)
  Top 0.254: v15.7,25.15 15.49,25.15 14.88,24.54 13.46,24.54 R6.1 | v17.32,16.61 17.32,15.39 IC5.27 | v31.14,35.31 30.94,35.1 29.52,35.1 C16.1 | v31.14,27.99 30.12,26.98 30.12,24.54 29.92,24.33 29.72,24.33 28.09,22.71 28.09,20.68 IN_AMP.6
  Route2 0.254: v15.7,25.15 15.7,23.52 14.88,22.71 14.88,19.05 v17.32,16.61 19.15,16.61 21.39,14.38 23.62,14.38 26.87,17.63 26.87,23.93 30.94,27.99 v31.14,27.99
  Bottom 0.254: DEBUG.2 35,43.64 35,42.01 31.14,38.15 v31.14,35.31 v31.14,27.99
INT_OUT  (via drill 0.48)
  Top 0.254: v11.63,29.21 12.65,29.21 C8.2 | v15.9,28.6 17.73,26.77 IC2.1
  Route15 0.254: v15.9,28.6 20.98,28.6 24.84,24.74 36.22,24.74 36.63,25.15 37.85,25.15 REFERENCE.1
  Bottom 0.254: v11.63,29.21 15.29,29.21 v15.9,28.6
LOW_PASS  (via drill 0.48)
  Top 0.254: v37.85,2.18 39.27,2.18 C17.1 | R15.1 35.2,21.49 37.64,21.49 38.25,22.1 39.27,22.1 42.52,18.85 42.52,17.02 35.81,10.31 35.81,9.5 35.2,8.89 v33.78,8.89 C57.2 31.34,8.89 31.34,11.73 30.53,12.55 IC4.1 30.53,12.75 30.53,13.77 IC4.2 | v17.93,17.83 17.32,17.83 15.7,16.2 15.7,15.39 IC5.25
  Bottom 0.254: v37.85,2.18 37.85,4.83 33.98,8.69 | v17.93,17.83 19.15,19.05 19.15,31.04 26.26,38.15 30.33,38.15 | 30.33,38.15 30.53,38.15 31.14,38.76 31.14,42.62 30.12,43.64 DEBUG.4 | 33.98,8.69 40.49,15.19 40.49,16.41 38.86,18.03 37.64,18.03 30.33,25.35 30.33,38.15 | 33.98,8.69 v33.78,8.89
MISO  (via drill 0.48)
  Top 0.254: v13.67,23.32 14.07,23.72 15.49,23.72 IC5.16
  Bottom 0.254: v13.67,23.32 16.71,26.37 16.71,30.02 6.76,39.98 5.74,39.98 4.93,40.79 4.93,42.42 6.15,43.64 ICSP.9
MOSI
  Top 0.254: IC5.15 16.51,23.93 16.51,24.54 17.32,25.35 19.76,25.35 19.76,29.41 18.54,30.63 18.54,33.27 18.34,33.48 6.35,33.48 ICSP.1
N$1
  Top 0.254: R13.1 32.56,25.76 30.73,25.76 IN_AMP.1
N$2
  Top 0.254: IN_AMP.8 30.73,21.29 32.56,23.11 32.56,23.93 R13.2
N$3  (via drill 0.48)
  Top 0.254: IN_AMP.3 28.3,25.76 28.3,27.99 28.7,28.4 29.11,28.4 IC7.1 29.11,28.6 29.11,29.82 IC7.2 29.11,30.02 28.3,30.02 26.67,31.65 v25.65,31.65
  Bottom 0.254: v25.65,31.65 24.23,31.65 19.56,26.98 19.56,16.82 14.68,11.94 14.68,6.25 D1.3
N$4
  Top 0.254: IC7.3 29.31,31.04 33.78,31.04 35.2,29.62 INPUT_RAW.2
N$5
  Top 0.254: IC7.5 24.03,32.46 27.28,32.46 28.91,34.09 31.14,34.09 34.8,37.74 34.8,39.78 INPUT_RAW.5
N$6  (via drill 0.48, 0.48 layers 15-16)
  Top 0.254: v23.83,36.93 22.61,36.93 R5.2 | v36.63,37.13 39.47,39.98 39.47,41.2 R4.2
  Route15 0.254: v23.83,36.93 v27.69,33.07 30.12,33.07 34.19,37.13 v36.63,37.13
  Bottom 0.254: v27.69,33.07 27.69,31.04 29.31,29.41 IC3.1
N$7
  Top 0.254: R6.2 11.84,24.54 13.26,25.96 13.67,25.96 14.07,26.37 14.07,28.8 C8.1 14.68,29.41 17.12,29.41 19.15,27.38 19.15,26.77 IC2.2
N$8  (via drill 0.48)
  Top 0.254: v36.42,15.19 35.2,15.19 C19.2 | v33.78,19.05 34.39,19.66 35,19.66 R15.2
  Bottom 0.254: R17.1 34.8,15.19 v36.42,15.19 36.63,15.39 36.63,17.02 34.59,19.05 v33.78,19.05
N$9  (via drill 0.48)
  Top 0.254: v36.02,25.76 34.8,25.76 R18.2 | v38.05,18.85 38.05,16.82 37.24,16 37.24,12.55 35,10.31 C18.1 | v41.1,3.4 41.1,2.18 C17.2
  Bottom 0.254: v36.02,25.76 36.02,20.88 v38.05,18.85 38.66,18.85 41.1,16.41 v41.1,3.4
N$11  (via drill 0.48, 0.48 layers 1-2)
  Top 0.254: IC7.6 24.03,31.04 24.03,30.02 IC7.7 24.03,29.82 24.64,29.82 v26.87,27.58 | v27.69,23.52 28.5,24.33 28.7,24.33 29.31,24.94 29.31,25.55 IN_AMP.2 29.31,25.76 29.11,25.96 v29.11,27.58
  Route2 0.254: v27.28,7.26 27.28,23.11 v27.69,23.52
  Bottom 0.254: v27.28,7.26 26.06,7.26 D2.3 | v29.11,27.58 v26.87,27.58
N$21  (via drill 0.48)
  Top 0.254: 1.47,18.64 1.47,20.88 R2.1 | 1.47,18.64 1.47,16.61 C4.1 | v15.7,20.88 15.09,21.49 14.28,21.49 IC5.18 | 1.47,18.64 v4.32,18.64
  Bottom 0.254: v15.7,20.88 10.82,20.88 10.41,21.29 6.96,21.29 v4.32,18.64
N$27  (via drill 0.48)
  Top 0.254: v10.01,20.47 11.84,20.47 C3.1 | v7.77,18.24 7.77,17.42 Q1.2 | v20.37,22.3 22.61,22.3 IC5.8
  Route15 0.254: v20.37,22.3 18.54,22.3 16.31,20.07 10.41,20.07 v10.01,20.47
  Bottom 0.254: v7.77,18.24 v10.01,20.47
N$28  (via drill 0.48)
  Top 0.254: C2.1 9.4,22.5 v8.18,22.5 5.74,22.5 5.33,22.91 Q1.1 | v17.53,22.5 18.54,21.49 22.61,21.49 IC5.7
  Route15 0.254: v17.53,22.5 17.12,22.5 16.31,23.32 14.88,23.32 14.07,22.5 v8.18,22.5
N$29
  Top 0.254: R40.2 33.17,17.42 33.98,17.42 35.41,18.85 36.83,18.85 38.66,20.68 TR1.1
N$105  (via drill 0.48, 0.48 layers 1-2)
  Top 0.254: 32.97,13.97 32.97,15.39 R40.1 | 32.97,13.97 32.97,12.75 R38.1 | 32.97,13.97 v32.77,13.97 | v30.33,11.53 30.33,11.33 28.7,9.7 27.69,9.7 27.28,10.11 27.28,13.77 26.06,14.99 25.25,14.99 IC4.6
  Route2 0.254: v32.77,13.97 v30.33,11.53
  Bottom 0.254: v32.77,13.97 32.16,14.58 32.16,15.8 32.97,16.61 32.97,17.22 C53.1
N$107  (via drill 0.48)
  Top 0.254: R46.2 32.56,19.66 32.56,18.24 31.95,17.63 31.95,16 31.14,15.19 30.53,15.19 IC4.3 30.33,14.99 29.52,14.99 v28.09,13.56 | v14.68,15.39 14.48,15.6 11.43,15.6 C59.1
  Route15 0.254: v14.68,15.39 26.26,15.39 v28.09,13.56
N$108  (via drill 0.48 layers 1-2)
  Top 0.254: R44.2 29.52,18.24 30.33,18.24 31.75,19.66 31.75,20.68 32.56,21.49 R46.1 32.77,21.69 v33.78,20.68 | v30.53,10.31 29.72,9.5 29.72,8.89 C57.1
  Route2 0.254: v30.53,10.31 33.58,13.36 33.58,18.03 32.97,18.64 32.97,19.86 v33.78,20.68
NOTCH  (via drill 0.48)
  Top 0.254: v28.5,15.6 26.67,15.6 26.06,16.2 25.25,16.2 IC4.5 | v34.19,11.33 33.17,10.31 C18.2 | v17.93,19.05 15.7,16.82 14.28,16.82 IC5.24
  Route2 0.254: v28.5,15.6 31.95,19.05 31.95,28.4 28.91,31.45 28.91,40.39 27.48,41.81 27.48,43.64 DEBUG.5
  Route15 0.254: v17.93,19.05 19.56,17.42 19.56,16.2 19.96,15.8 28.3,15.8 v28.5,15.6
  Bottom 0.254: 32.97,18.24 31.14,18.24 v28.5,15.6 | 32.97,18.24 33.58,18.24 33.98,17.83 33.98,16.82 33.17,16 33.17,15.39 R17.2 | v34.19,11.33 36.02,11.33 40.08,15.39 40.08,16.2 38.66,17.63 36.63,17.63 34.39,19.86 33.38,19.86 32.97,19.46 32.97,18.24
OUT  (via drill 0.48, 0.48 layers 1-2, 0.48 layers 15-16)
  Top 0.254: R38.2 34.8,13.16 v35.61,13.97 | v21.39,17.22 18.75,19.86 17.53,19.86 15.29,17.63 14.28,17.63 IC5.23 | v23.22,15.19 24.44,13.97 25.04,13.97 IC4.7
  Route2 0.254: v23.22,15.19 21.39,17.02 v21.39,17.22 22.2,18.03 22.2,38.15 20.37,39.98 19.56,39.17 18.75,39.17 M3.2
  Route15 0.254: 35.61,16 v35.61,13.97 | v21.39,17.22 21.39,16.61 21.59,16.41 35.2,16.41 35.61,16 | 35.61,16 v35.81,16.2
  Bottom 0.254: DEBUG.6 24.84,43.64 23.22,43.64 18.75,39.17 M3.2 | v35.81,16.2 34.8,17.22 C53.2
REF  (via drill 0.48)
  Top 0.254: v26.06,23.32 26.87,22.5 26.87,20.68 IN_AMP.5
  Route15 0.254: v26.06,23.32 26.87,24.13 39.27,24.13 40.28,25.15 REFERENCE.2
RST  (via drill 0.48, 0.48 layers 1-2)
  Top 0.254: v11.02,27.79 C1.1 | v14.68,25.76 14.68,26.77 R1.2 | v18.95,18.44 18.95,15.39 IC5.29
  Route2 0.254: v18.95,18.44 18.95,23.11 16.1,25.96 14.88,25.96 v14.68,25.76
  Bottom 0.254: ICSP.5 6.35,38.56 7.37,37.54 7.37,32.26 11.02,28.6 v11.02,27.79 13.06,25.76 v14.68,25.76
RX_HV  (via drill 0.48)
  Top 0.254: v15.49,13.97 R20.1 15.9,12.34 v15.9,11.73 | v7.37,13.56 5.74,11.94 3.3,11.94 Q3.3 | v20.37,16.61 20.37,15.39 IC5.31
  Bottom 0.254: SERIAL_UC.3 24.84,39.98 18.75,33.88 18.75,22.5 15.49,19.25 v15.49,13.97 15.09,13.56 v7.37,13.56 | v20.37,16.61 20.37,16.2 v15.9,11.73
RX_LV
  Top 0.254: 4.52,9.3 4.32,9.3 Q3.2 4.52,9.3 | 4.52,9.3 5.94,9.3 R16.1 | 4.52,9.3 4.52,4.62 3.51,3.61 WIFI.8
SCK  (via drill 0.48)
  Top 0.254: v15.9,22.5 14.28,22.5 IC5.17
  Bottom 0.254: v15.9,22.5 15.9,24.94 17.12,26.16 17.12,30.43 6.35,41.2 ICSP.7
TX_HV  (via drill 0.48, 0.48 layers 1-2)
  Top 0.254: v7.77,12.34 7.98,12.14 7.98,11.12 R9.1 | v15.9,10.52 16.71,10.52 16.92,10.72 Q2.3 | v19.56,13.77 19.56,15.19 IC5.30
  Route2 0.254: v7.77,12.34 8.18,12.34 10.01,10.52 v15.9,10.52 16.71,9.7 18.54,9.7 19.56,10.72 v19.56,13.77 18.95,13.77 14.48,18.24 14.48,23.72 13.87,24.33 13.87,27.79 v20.37,34.29
  Bottom 0.254: v20.37,34.29 20.37,34.7 23.42,37.74 25.25,37.74 27.48,39.98 SERIAL_UC.2
TX_LV
  Top 0.254: R8.1 10.62,9.09 10.62,6.66 11.02,6.25 WIFI.1 11.23,6.25 15.49,6.25 17.53,8.28 17.93,8.28 Q2.2
VIN
  Top 0.254: 23.62,8.08 23.62,6.05 27.08,2.59 POWER_IN.2 | 23.62,8.08 C6.1 23.62,8.69 | 23.62,8.08 39.88,8.08 42.52,5.44 LM117.3